# Altium schematic sheet EEpromConfig.SchDoc: BaseBand Front-End
size A3; Revision: 1; SheetNumber: 7
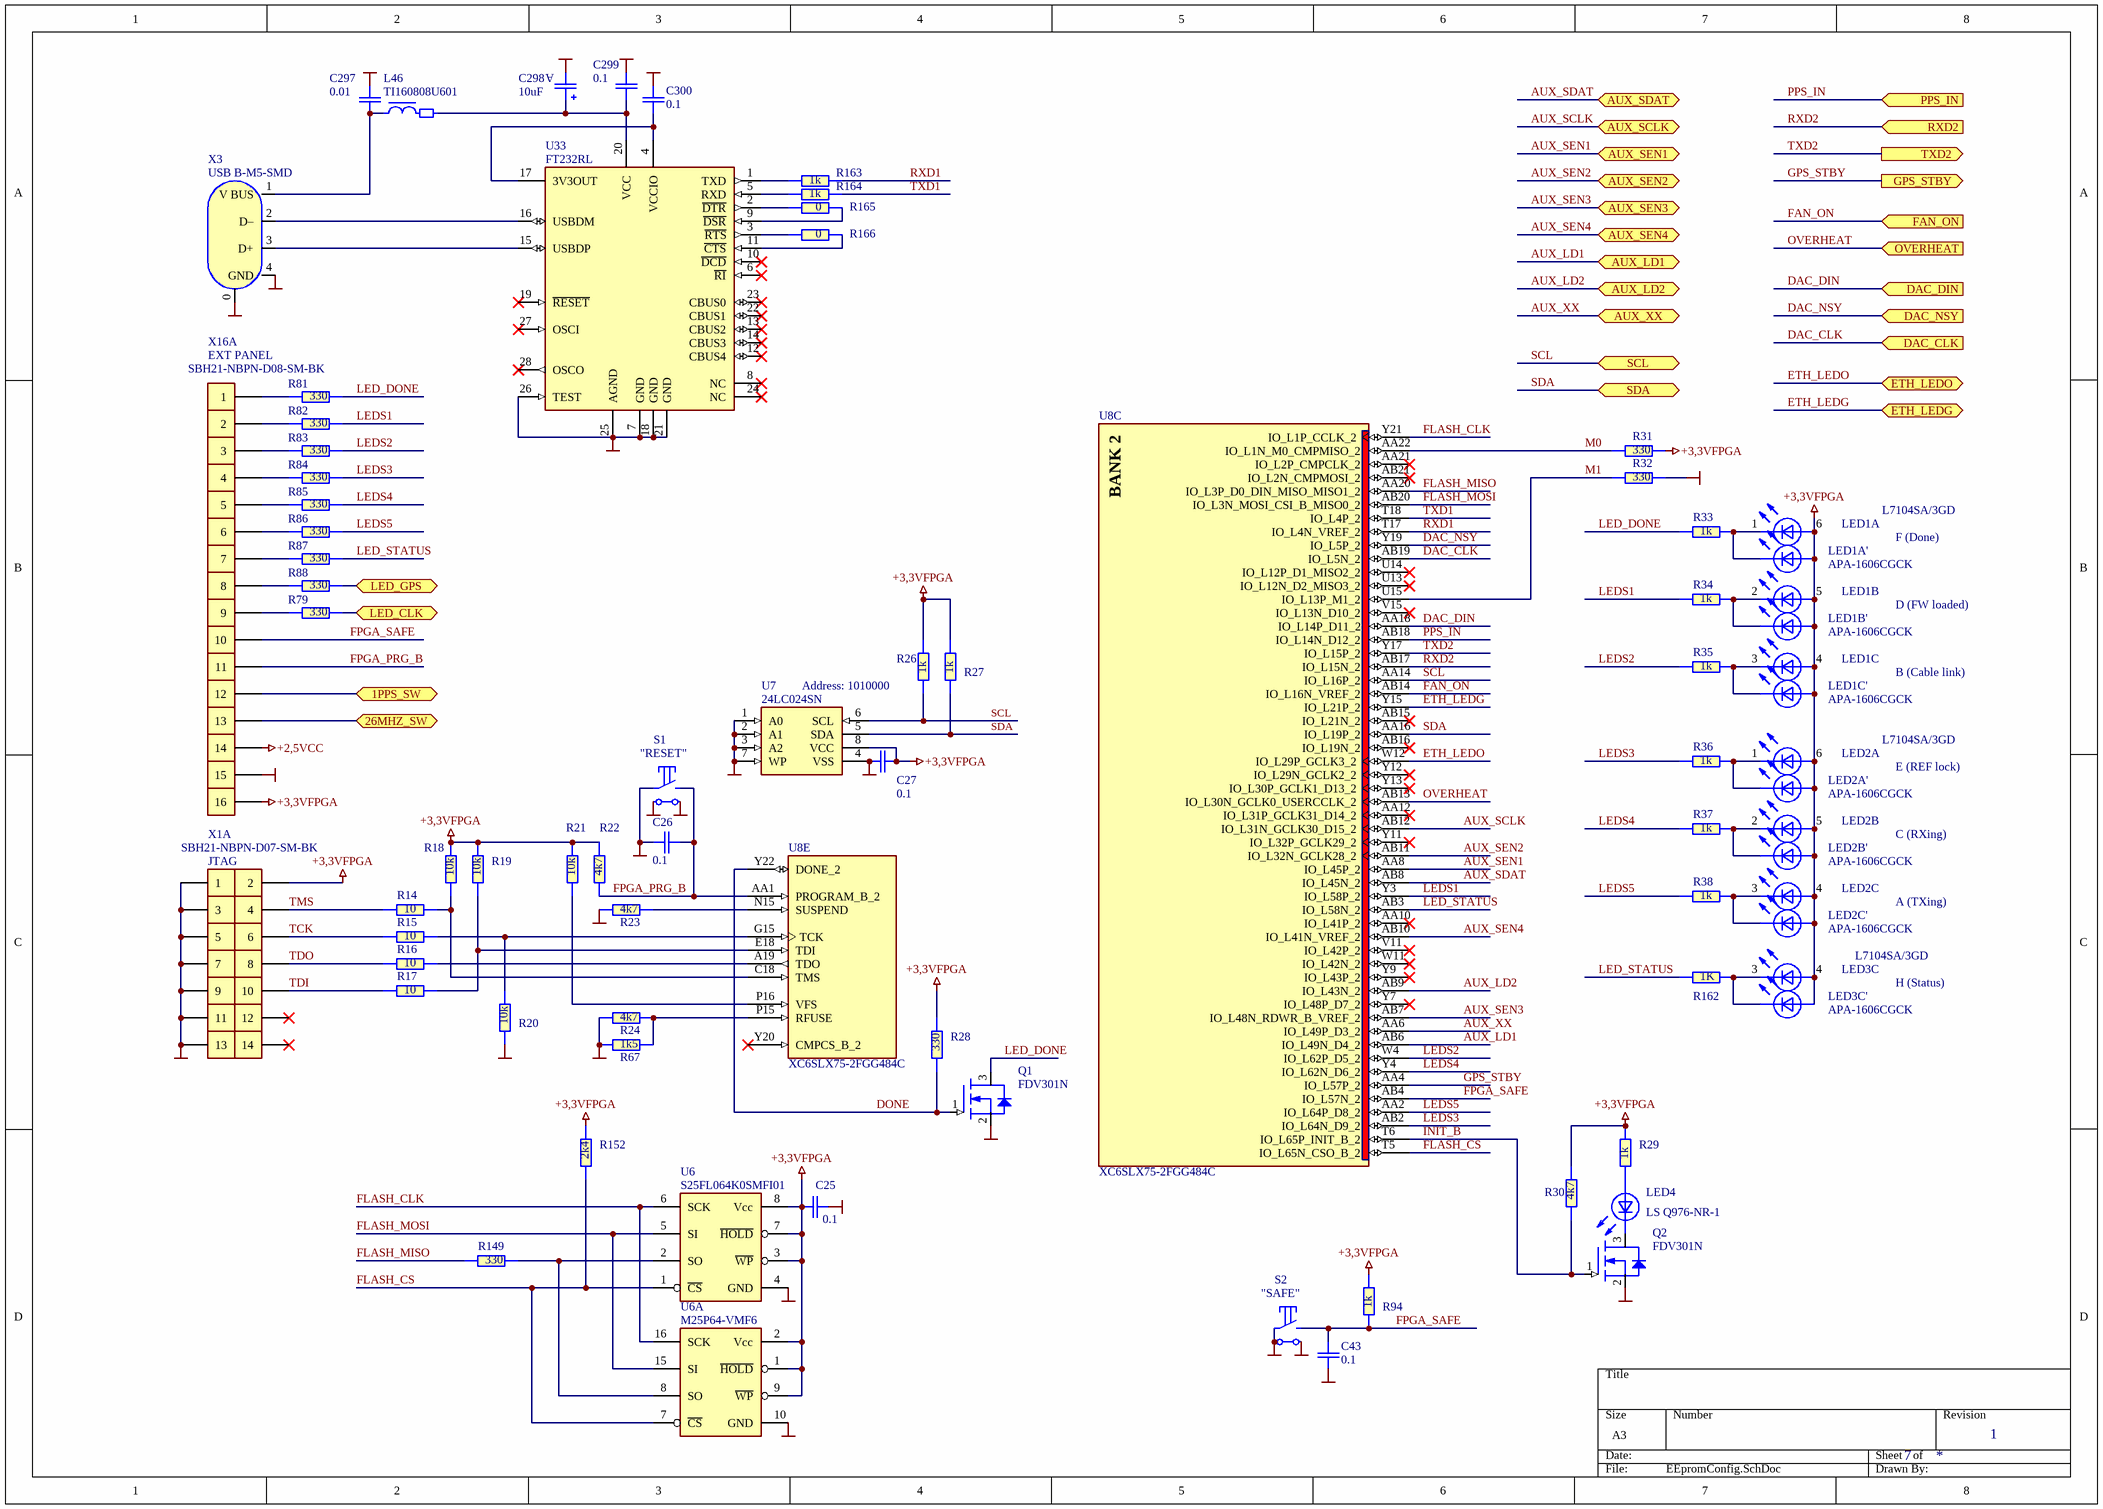
[diagram p0: EEpromConfig.SchDoc]

## Parts
C25  0.1  [C0402-Phillips]
C26  0.1  [C0402-Phillips]
C27  0.1  [C0402-Phillips]
C43  0.1  [C0402-Phillips]
C297  0.01  [C0402-Phillips]
C298  10uF  [CA3216]
C299  0.1  [C0402-Phillips]
C300  0.1  [C0402-Phillips]
L46  TI160808U601  [Ti160808-Phillips]
LED1  L7104SA/3GD  [L-7104SA/3]  (value not drawn)  (parts A,B,C of 3)
LED1A'  APA-1606CGCK  [KPA-1606g]
LED1B'  APA-1606CGCK  [KPA-1606g]
LED1C'  APA-1606CGCK  [KPA-1606g]
LED2  L7104SA/3GD  [L-7104SA/3]  (value not drawn)  (parts A,B,C of 3)
LED2A'  APA-1606CGCK  [KPA-1606g]
LED2B'  APA-1606CGCK  [KPA-1606g]
LED2C'  APA-1606CGCK  [KPA-1606g]
LED3  L7104SA/3GD  [L-7104SA/3]  (part C of 3)
LED3C'  APA-1606CGCK  [KPA-1606g]
LED4  LS Q976-NR-1  [LED-0603y]
Q1  FDV301N  [SOT23-Philips]
Q2  FDV301N  [SOT23-Philips]
R14  10  [R0603-PHILLIPS]
R15  10  [R0603-PHILLIPS]
R16  10  [R0603-PHILLIPS]
R17  10  [R0603-PHILLIPS]
R18  10k  [R0603-PHILLIPS]
R19  10k  [R0603-PHILLIPS]
R20  10k  [R0603-PHILLIPS]
R21  10k  [R0603-PHILLIPS]
R22  4k7  [R0603-PHILLIPS]
R23  4k7  [R0603-PHILLIPS]
R24  4k7  [R0603-PHILLIPS]
R26  1k  [R0603-PHILLIPS]
R27  1k  [R0603-PHILLIPS]
R28  330  [R0603-PHILLIPS]
R29  1k  [R0603-PHILLIPS]
R30  4k7  [R0603-PHILLIPS]
R31  330  [R0603-PHILLIPS]
R32  330  [R0603-PHILLIPS]
R33  1k  [R0603-PHILLIPS]
R34  1k  [R0603-PHILLIPS]
R35  1k  [R0603-PHILLIPS]
R36  1k  [R0603-PHILLIPS]
R37  1k  [R0603-PHILLIPS]
R38  1k  [R0603-PHILLIPS]
R67  1k5  [R0603-PHILLIPS]
R79  330  [R0603-PHILLIPS]
R81  330  [R0603-PHILLIPS]
R82  330  [R0603-PHILLIPS]
R83  330  [R0603-PHILLIPS]
R84  330  [R0603-PHILLIPS]
R85  330  [R0603-PHILLIPS]
R86  330  [R0603-PHILLIPS]
R87  330  [R0603-PHILLIPS]
R88  330  [R0603-PHILLIPS]
R94  1k  [R0603-PHILLIPS]
R149  330  [R0603-PHILLIPS]
R152  2k4  [R0603-PHILLIPS]
R162  1K  [R0603-PHILLIPS]
R163  1k  [R0603-PHILLIPS]
R164  1k  [R0603-PHILLIPS]
R165  0  [R0603-PHILLIPS]
R166  0  [R0603-PHILLIPS]
S1  Misc: "RESET"  [TL3340]  (hidden comment: TL3340AF160QG)
S2  Misc: "SAFE"  [TL3340]  (hidden comment: TL3340AF160QG)
U6  S25FL064K0SMFI01  [SO-8[wide200]]
U6A  M25P64-VMF6  [so-16W]
U7  24LC024SN  Address: 1010000  [SOIC8]
U8  XC6SLX75-2FGG484C  [FBGA484]  (parts C,E of 8)
U33  FT232RL  [SSOP-28(5.3X10/0.65)]
X1  SBH21-NBPN-D07-SM-BK  Other: JTAG  [SBH-14]  (parts A,B,C,D,E,F,G,H,I,J,K,L,M,N of 14)
X3  USB B-M5-SMD  [USB/SM0.8-6H5]
X16  SBH21-NBPN-D08-SM-BK  Misc: EXT PANEL  [SBH-16]  (parts A,B,C,D,E,F,G,H,I,J,K,L,M,N,O,P of 16)

## Ports
1PPS_SW, 26MHZ_SW, AUX_LD1, AUX_LD2, AUX_SCLK, AUX_SDAT, AUX_SEN1, AUX_SEN2, AUX_SEN3, AUX_SEN4, AUX_XX, DAC_CLK (in), DAC_DIN (in), DAC_NSY (in), ETH_LEDG, ETH_LEDO, FAN_ON (in), GPS_STBY (out), LED_CLK, LED_GPS, OVERHEAT (in), PPS_IN (in), RXD2 (in), SCL, SDA, TXD2 (out)

## Nets
+2,5VCC: X16.14
+3,3VFPGA: C25.1 C27.2 LED1.4(A3) LED1.5(A2) LED1.6(A1) LED1A'.2(A) LED1B'.2(A) LED1C'.2(A) LED2.4(A3) LED2.5(A2) LED2.6(A1) LED2A'.2(A) LED2B'.2(A) LED2C'.2(A) LED3.4(A3) LED3C'.2(A) R18.1 R19.1 R21.1 R22.1 R26.1 R27.1 R28.1 R29.1 R30.1 R31.2 R94.1 R152.1 U6.3(~{WP}) U6.7(~{HOLD}) U6.8(Vcc) U6A.1(~{HOLD}) U6A.2(Vcc) U6A.9(~{WP}) U7.8(VCC) X1.2 X16.16
GND: C25.2 C26.2 C27.1 C43.1 C297.1 C298.2(-) C299.2 C300.2 Q1.2(S) Q2.2(S) R20.2 R23.1 R24.1 R32.2 R67.1 S1.2 S1.3 S1.4 S2.2 S2.3 S2.4 U6.4(GND) U6A.10(GND) U7.1(A0) U7.2(A1) U7.3(A2) U7.4(VSS) U7.7(WP) U33.7(GND) U33.18(GND) U33.21(GND) U33.25(AGND) U33.26(TEST) X1.1 X1.3 X1.5 X1.7 X1.9 X1.11 X1.13 X3.0(GND) X3.4(GND) X16.15
1PPS_SW: X16.12 ; port 1PPS_SW
26MHZ_SW: X16.13 ; port 26MHZ_SW
AUX_LD1: U8.AB6(IO_L49N_D4_2) ; port AUX_LD1
AUX_LD2: U8.AB9(IO_L43N_2) ; port AUX_LD2
AUX_SCLK: U8.AB12(IO_L31N_GCLK30_D15_2) ; port AUX_SCLK
AUX_SDAT: U8.AB8(IO_L45N_2) ; port AUX_SDAT
AUX_SEN1: U8.AA8(IO_L45P_2) ; port AUX_SEN1
AUX_SEN2: U8.AB11(IO_L32N_GCLK28_2) ; port AUX_SEN2
AUX_SEN3: U8.AB7(IO_L48N_RDWR_B_VREF_2) ; port AUX_SEN3
AUX_SEN4: U8.AB10(IO_L41N_VREF_2) ; port AUX_SEN4
AUX_XX: U8.AA6(IO_L49P_D3_2) ; port AUX_XX
DAC_CLK: U8.AB19(IO_L5N_2) ; port DAC_CLK
DAC_DIN: U8.AA18(IO_L14P_D11_2) ; port DAC_DIN
DAC_NSY: U8.Y19(IO_L5P_2) ; port DAC_NSY
DONE: Q1.1(G) R28.2 U8.Y22(DONE_2)
ETH_LEDG: U8.Y15(IO_L21P_2) ; port ETH_LEDG
ETH_LEDO: U8.W12(IO_L29P_GCLK3_2) ; port ETH_LEDO
FAN_ON: U8.AB14(IO_L16N_VREF_2) ; port FAN_ON
FLASH_CLK: U6.6(SCK) U6A.16(SCK) U8.Y21(IO_L1P_CCLK_2)
FLASH_CS: R152.2 U6.1(~{CS}) U6A.7(~{CS}) U8.T5(IO_L65N_CSO_B_2)
FLASH_MISO: R149.1 U8.AA20(IO_L3P_D0_DIN_MISO_MISO1_2)
FLASH_MOSI: U6.5(SI) U6A.15(SI) U8.AB20(IO_L3N_MOSI_CSI_B_MISO0_2)
FPGA_PRG_B: C26.1 R22.2 S1.1 U8.AA1(PROGRAM_B_2) X16.11
FPGA_SAFE: C43.2 R94.2 S2.1 U8.AB4(IO_L57N_2) X16.10
GPS_STBY: U8.AA4(IO_L57P_2) ; port GPS_STBY
INIT_B: Q2.1(G) R30.2 U8.T6(IO_L65P_INIT_B_2)
LED_CLK: R79.2 ; port LED_CLK
LED_DONE: Q1.3(D) R33.2 R81.2
LED_GPS: R88.2 ; port LED_GPS
LED_STATUS: R87.2 R162.1 U8.AB3(IO_L58N_2)
LEDS1: R34.2 R82.2 U8.Y3(IO_L58P_2)
LEDS2: R35.2 R83.2 U8.W4(IO_L62P_D5_2)
LEDS3: R36.2 R84.2 U8.AB2(IO_L64N_D9_2)
LEDS4: R37.2 R85.2 U8.Y4(IO_L62N_D6_2)
LEDS5: R38.2 R86.2 U8.AA2(IO_L64P_D8_2)
M0: R31.1 U8.AA22(IO_L1N_M0_CMPMISO_2)
M1: R32.1 U8.U15(IO_L13P_M1_2)
OVERHEAT: U8.AB13(IO_L30N_GCLK0_USERCCLK_2) ; port OVERHEAT
PPS_IN: U8.AB18(IO_L14N_D12_2) ; port PPS_IN
RXD1: R163.1 U8.T17(IO_L4N_VREF_2)
RXD2: U8.AB17(IO_L15N_2) ; port RXD2
SCL: R26.2 U7.6(SCL) U8.AA14(IO_L16P_2) ; port SCL
SDA: R27.2 U7.5(SDA) U8.AA16(IO_L19P_2) ; port SDA
TCK: R15.1 X1.6
TDI: R17.1 X1.10
TDO: R16.1 X1.8
TMS: R14.1 X1.4
TXD1: R164.1 U8.T18(IO_L4P_2)
TXD2: U8.Y17(IO_L15P_2) ; port TXD2
NetC297_2: C297.2 L46.1 X3.1(V_BUS)
NetC298_1: C298.1(+) C299.1 L46.2 U33.20(VCC)
NetC300_1: C300.1 U33.4(VCCIO) U33.17(3V3OUT)
NetLED1_1: LED1.1(K1) LED1A'.1(K) R33.1
NetLED1_2: LED1.2(K2) LED1B'.1(K) R34.1
NetLED1_3: LED1.3(K3) LED1C'.1(K) R35.1
NetLED2_1: LED2.1(K1) LED2A'.1(K) R36.1
NetLED2_2: LED2.2(K2) LED2B'.1(K) R37.1
NetLED2_3: LED2.3(K3) LED2C'.1(K) R38.1
NetLED3_3: LED3.3(K3) LED3C'.1(K) R162.2
NetLED4_1: LED4.1(K) Q2.3(D)
NetLED4_2: LED4.2(A) R29.2
NetR14_2: R14.2 R18.2 U8.C18(TMS)
NetR15_2: R15.2 R20.1 U8.G15(TCK)
NetR16_2: R16.2 U8.A19(TDO)
NetR17_2: R17.2 R19.2 U8.E18(TDI)
NetR21_2: R21.2 U8.P16(VFS)
NetR23_2: R23.2 U8.N15(SUSPEND)
NetR24_2: R24.2 R67.2 U8.P15(RFUSE)
NetR79_1: R79.1 X16.9
NetR81_1: R81.1 X16.1
NetR82_1: R82.1 X16.2
NetR83_1: R83.1 X16.3
NetR84_1: R84.1 X16.4
NetR85_1: R85.1 X16.5
NetR86_1: R86.1 X16.6
NetR87_1: R87.1 X16.7
NetR88_1: R88.1 X16.8
NetR149_2: R149.2 U6.2(SO) U6A.8(SO)
NetR163_2: R163.2 U33.1(TXD)
NetR164_2: R164.2 U33.5(RXD)
NetR165_1: R165.1 U33.2(~{DTR})
NetR165_2: R165.2 U33.9(~{DSR})
NetR166_1: R166.1 U33.3(~{RTS})
NetR166_2: R166.2 U33.11(~{CTS})
NetU33_15: U33.15(USBDP) X3.3(D+)
NetU33_16: U33.16(USBDM) X3.2(D–)

Not connected (* = marked no-connect by the designer): U8 AA10(IO_L41P_2)* AA12(IO_L31P_GCLK31_D14_2)* AA21(IO_L2P_CMPCLK_2)* AB15(IO_L21N_2)* AB16(IO_L19N_2)* AB21(IO_L2N_CMPMOSI_2)* U13(IO_L12N_D2_MISO3_2)* U14(IO_L12P_D1_MISO2_2)* V11(IO_L42P_2)* V15(IO_L13N_D10_2)* W11(IO_L42N_2)* Y7(IO_L48P_D7_2)* Y9(IO_L43P_2)* Y11(IO_L32P_GCLK29_2)* Y12(IO_L29N_GCLK2_2)* Y13(IO_L30P_GCLK1_D13_2)* Y20(CMPCS_B_2)*; U33 6(~{RI})* 8(NC)* 10(~{DCD})* 12(CBUS4)* 13(CBUS2)* 14(CBUS3)* 19(~{RESET})* 22(CBUS1)* 23(CBUS0)* 24(NC)* 27(OSCI)* 28(OSCO)*; X1 12* 14*

## Notes on the sheet
- F (Done)
- D (FW loaded)
- B (Cable link)
- E (REF lock)
- C (RXing)
- A (TXing)
- H (Status)
- (in symbol CA3216) A
- (in symbol XC6SLX75-2FGG484C, part C) BANK 2

## Library data of the parts
C25-C27 C43 C297 C299 C300 = C0402: Конденсатор; Manufacturer: MURATA; Tolerance: 20%; Name: SMD0402; U/P/TKE: Y5V
  C25-C27 C43 C299 C300: Value: 0.1
  C297: Value: 0.01
C298 = CA3216: Конденсатор; Manufacturer: SPRAGUE; Name: Case A; U/P/TKE: 10V; Value: 10uF
L46 = TI160808: Дроссель ЭМС; Manufacturer: MURATA; Name: TI160808U601; Value: *
LED1-LED3 = L7104SA/3: Светодиод; Manufacturer: KINGBRIGTH; PDF: d:\Proj\Components\Kingbright\L-7104SA-3GD(Ver.4).pdf; Name: L7104SA/3GD
LED1A' LED1B' LED1C' LED2A' LED2B' LED2C' LED3C' = KPA-1606: Светодиод; Manufacturer: Kingbright; Name: APA-1606CGCK
LED4 = LED0603: LED SMD; Manufacturer: OSRAM Opto Semiconductors Inc; Name: LS Q976-NR-1
Q1 Q2 = FDV301N: Транзистор; Manufacturer: Fairchild; PDF: D:\Proj\Components\FairChild\FDV301N.pdf; Name: FDV301N
R14-R24 R26-R38 R67 R79 R81-R88 R94 R149 R152 R162-R166 = R0603: Резистор; Manufacturer: YAGEO; Tolerance: 5%; Name: SMD0603; U/P/TKE: 0.1W
  R14-R17: Value: 10
  R18-R21: Value: 10k
  R22-R24 R30: Value: 4k7
  R26 R27 R29 R33-R38 R94 R163 R164: Value: 1k
  R28 R31 R32 R79 R81-R88 R149: Value: 330
  R67: Value: 1k5
  R152: Value: 2k4
  R162: Value: 1K
  R165 R166: Value: 0
S1 S2 = TL3340AF160QG: Switch Tactile SMD right angle; Manufacturer: E-Switch; Name: TL3340AF160QG
U6 = S25FL064K: Микросхема; Manufacturer: SPANSION; Swap: No; Name: S25FL064K0SMFI01
U6A = M25P64-VMF6: Микросхема; Manufacturer: ST; Swap: No; Name: M25P64-VMF6
U7 = AT24CXX: Микросхема; Manufacturer: Microchip; Swap: No; PDF: d:\Proj\components\Atmel\AT24C02A_04A_08A_16A.pdf; PDF2: d:\Proj\Components\Atmel\AT24C04B_08B.pdf; Name: 24LC024SN; Supplier 1: Digi-Key
U8 = XC6SLX75-2FGG484C: Spartan-6 LX 1.2V FPGA, 270 User I/Os, 484-Ball Fine-Pitch BGA (1.0mm Pitch), Speed Grade 2, Commercial Grade, Pb-Free; Manufacturer: Xilinx; Published: 1-Jul-2010; Supplier 1: Digi-Key; Supplier Part Number 1: XC6SLX75-2FGG484C-ND; ComponentLink1Description: Manufacturer Link; ComponentLink1URL: http://www.xilinx.com; ComponentLink2Description: Spartan-6 Datasheet; ComponentLink2URL: http://www.xilinx.com/support/documentation/data_sheets/ds160.pdf; ComponentLink3Description: Spartan-6 Documents; ComponentLink3URL: http://www.xilinx.com/support/documentation/spartan-6.htm; ComponentLink4Description: Xilinx.com Home; ComponentLink4URL: http://www.xilinx.com; Misc: Spartan-6 LX 1.2V FPGA; Name: XC6SLX75-2FGG484C
U33 = FT232RL: Микросхема; Manufacturer: FTDI; Misc: USB UART Asynchronous Serial Data Transfer Chip,; Name: FT232RL; ComponentLink1Description: Manufacturer Link; ComponentLink1URL: http://www.ftdichip.com/Products/ICs/FT232R.htm; ComponentLink2Description: Datasheet; ComponentLink2URL: http://www.ftdichip.com/Support/Documents/DataSheets/ICs/DS_FT232R.pdf
X1 = SBH21-7x2_SMD: Разъем; Manufacturer: Sullins; Name: SBH21-NBPN-D07-SM-BK
X3 = USB M-1J: Разъём; Name: USB B-M5-SMD
X16 = SBH21-8x2_SMD: Connector 2mm SMD; Manufacturer: Sullins; Name: SBH21-NBPN-D08-SM-BK